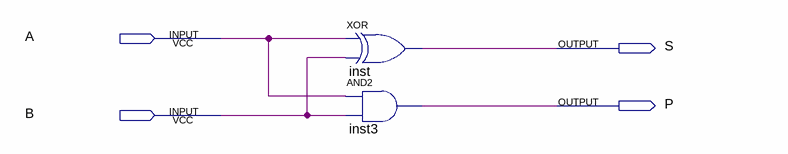
[diagram p0: schematic sheet]
// Quartus schematic Lesson_01.bdf as structural Verilog: 2 symbols, 4 pins
module Lesson_01 (
  input  A,
  input  B,
  output S,
  output P
);

  xor inst (S, A, B);
  and inst3 (P, A, B);
endmodule
